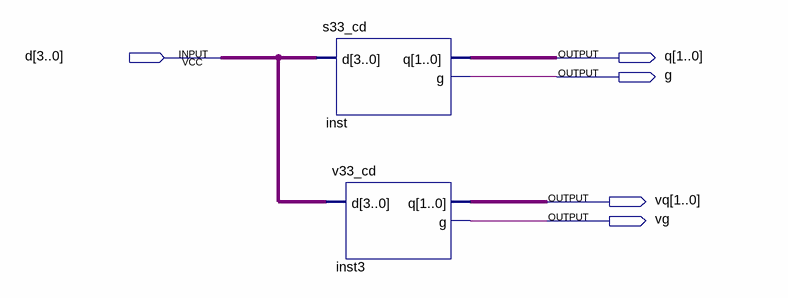
[diagram p0: schematic sheet]
// Quartus schematic sv33_cd.bdf as structural Verilog: 2 symbols, 5 pins
module sv33_cd (
  input  [3:0] d,
  output [1:0] q,
  output g,
  output [1:0] vq,
  output vg
);

  s33_cd inst (.d(d), .q(q), .g(g));
  v33_cd inst3 (.d(d), .q(vq), .g(vg));
endmodule
